# Altium schematic sheet AudioInputs_8.SchDoc
size Tabloid; DocumentNumber: 10; SheetNumber: 10; SheetTotal: 11; SheetName: Analog input (group)
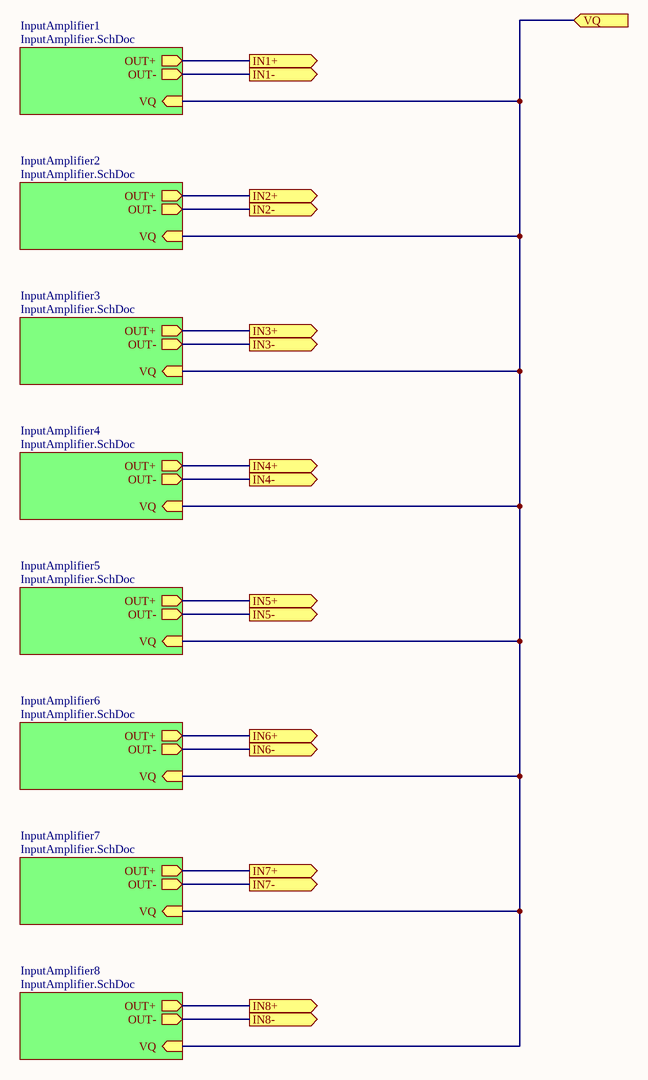
[diagram p0: AudioInputs_8.SchDoc]

## Sub-sheets
InputAmplifier1 = InputAmplifier.SchDoc: VQ (in), OUT+ (out), OUT- (out)
InputAmplifier2 = InputAmplifier.SchDoc: VQ (in), OUT+ (out), OUT- (out)
InputAmplifier3 = InputAmplifier.SchDoc: VQ (in), OUT+ (out), OUT- (out)
InputAmplifier4 = InputAmplifier.SchDoc: VQ (in), OUT+ (out), OUT- (out)
InputAmplifier5 = InputAmplifier.SchDoc: VQ (in), OUT+ (out), OUT- (out)
InputAmplifier6 = InputAmplifier.SchDoc: VQ (in), OUT+ (out), OUT- (out)
InputAmplifier7 = InputAmplifier.SchDoc: VQ (in), OUT+ (out), OUT- (out)
InputAmplifier8 = InputAmplifier.SchDoc: VQ (in), OUT+ (out), OUT- (out)

## Ports
IN1+ (out), IN1- (out), IN2+ (out), IN2- (out), IN3+ (out), IN3- (out), IN4+ (out), IN4- (out), IN5+ (out), IN5- (out), IN6+ (out), IN6- (out), IN7+ (out), IN7- (out), IN8+ (out), IN8- (out), VQ (in)

## Nets
IN1+: port IN1+, sheet InputAmplifier1/OUT+
IN1-: port IN1-, sheet InputAmplifier1/OUT-
IN2+: port IN2+, sheet InputAmplifier2/OUT+
IN2-: port IN2-, sheet InputAmplifier2/OUT-
IN3+: port IN3+, sheet InputAmplifier3/OUT+
IN3-: port IN3-, sheet InputAmplifier3/OUT-
IN4+: port IN4+, sheet InputAmplifier4/OUT+
IN4-: port IN4-, sheet InputAmplifier4/OUT-
IN5+: port IN5+, sheet InputAmplifier5/OUT+
IN5-: port IN5-, sheet InputAmplifier5/OUT-
IN6+: port IN6+, sheet InputAmplifier6/OUT+
IN6-: port IN6-, sheet InputAmplifier6/OUT-
IN7+: port IN7+, sheet InputAmplifier7/OUT+
IN7-: port IN7-, sheet InputAmplifier7/OUT-
IN8+: port IN8+, sheet InputAmplifier8/OUT+
IN8-: port IN8-, sheet InputAmplifier8/OUT-
VQ: port VQ, sheet InputAmplifier1/VQ, sheet InputAmplifier2/VQ, sheet InputAmplifier3/VQ, sheet InputAmplifier4/VQ, sheet InputAmplifier5/VQ, sheet InputAmplifier6/VQ, sheet InputAmplifier7/VQ, sheet InputAmplifier8/VQ

## Notes on the sheet
- Sheet name
- http://creativecommons.org
- Project name
- Contact
- Rev
- Date
- Sheet
- of